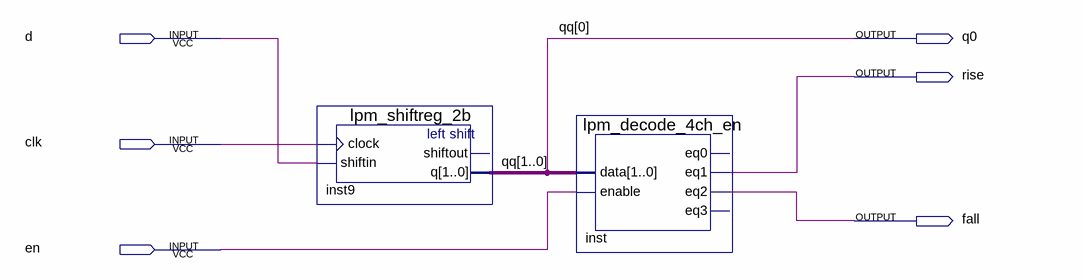
[diagram p0: schematic sheet]
// Quartus schematic edges.bdf as structural Verilog: 2 symbols, 6 pins
module edges (
  input  d,
  input  clk,
  input  en,
  output q0,
  output rise,
  output fall
);

  wire [1:1] qq;

  lpm_shiftreg_2b inst9 (.clock(clk), .shiftin(d), .q({qq[1], q0}));  // open: shiftout
  lpm_decode_4ch_en inst (.data({qq[1], q0}), .enable(en), .eq1(rise), .eq2(fall));  // open: eq0, eq3

  // Other names for the same wires on the sheet: qq[0] = q0
endmodule
